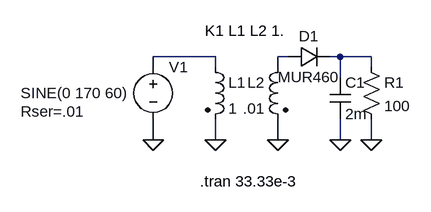
[diagram p0: schematic HWrecFiltt.asc]
HWrecFiltt.asc, the LTspice schematic file:
Version 4
SHEET 1 880 680
WIRE 80 160 -16 160
WIRE 192 160 176 160
WIRE 272 160 256 160
WIRE 320 160 272 160
WIRE -16 176 -16 160
WIRE 80 176 80 160
WIRE 176 176 176 160
WIRE 320 176 320 160
WIRE 272 192 272 160
WIRE -16 288 -16 256
WIRE 80 288 80 256
WIRE 176 288 176 256
WIRE 272 288 272 256
WIRE 320 288 320 256
FLAG -16 288 0
FLAG 80 288 0
FLAG 176 288 0
FLAG 320 288 0
FLAG 272 288 0
SYMBOL voltage -16 160 R0
WINDOW 3 -204 56 Left 0
WINDOW 123 0 0 Left 0
WINDOW 39 -204 84 Left 0
SYMATTR InstName V1
SYMATTR Value SINE(0 170 60)
SYMATTR SpiceLine Rser=.01
SYMBOL ind2 64 160 R0
SYMATTR InstName L1
SYMATTR Value 1
SYMATTR Type ind
SYMBOL ind2 192 160 M0
SYMATTR InstName L2
SYMATTR Value .01
SYMATTR Type ind
SYMBOL res 304 160 R0
SYMATTR InstName R1
SYMATTR Value 100
SYMBOL diode 192 144 M90
WINDOW 0 0 32 VBottom 0
WINDOW 3 32 32 VTop 0
SYMATTR InstName D1
SYMATTR Value MUR460
SYMBOL cap 256 192 R0
SYMATTR InstName C1
SYMATTR Value 2m
TEXT 56 352 Left 0 !.tran 33.33e-3
TEXT 64 120 Left 0 !K1 L1 L2 1.

The netlist it stands for:
* HWrecFiltt.asc
V1 N001 0 SINE(0 170 60) Rser=.01
L1 N001 0 1
L2 N002 0 .01
R1 N003 0 100
D1 N002 N003 MUR460
C1 N003 0 2m
.model D D
.lib standard.dio
.tran 33.33e-3
K1 L1 L2 1.
.backanno
.end